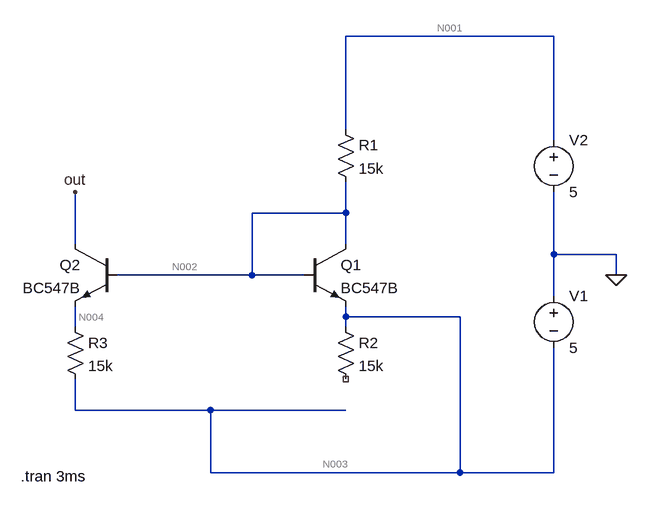
[diagram p0: schematic Draft1.asc]
Draft1.asc, the LTspice schematic file:
Version 4
SHEET 1 880 680
WIRE 528 -96 208 -96
WIRE 208 48 208 -96
WIRE 528 64 528 -96
WIRE 208 176 208 128
WIRE 208 176 64 176
WIRE -208 224 -208 144
WIRE 208 224 208 176
WIRE 528 240 528 144
WIRE 624 240 528 240
WIRE 64 272 64 176
WIRE 64 272 -144 272
WIRE 144 272 64 272
WIRE 624 272 624 240
WIRE 528 304 528 240
WIRE 208 336 208 320
WIRE 384 336 208 336
WIRE -208 352 -208 320
WIRE 208 352 208 336
WIRE -208 480 -208 432
WIRE 0 480 -208 480
WIRE 208 480 0 480
WIRE 0 576 0 480
WIRE 384 576 384 336
WIRE 384 576 0 576
WIRE 528 576 528 384
WIRE 528 576 384 576
FLAG 624 272 0
FLAG -208 144 out
SYMBOL res 192 32 R0
SYMATTR InstName R1
SYMATTR Value 15k
SYMBOL res 192 336 R0
SYMATTR InstName R2
SYMATTR Value 15k
SYMBOL npn 144 224 R0
SYMATTR InstName Q1
SYMATTR Value BC547B
SYMBOL npn -144 224 M0
SYMATTR InstName Q2
SYMATTR Value BC547B
SYMBOL res -224 336 R0
SYMATTR InstName R3
SYMATTR Value 15k
SYMBOL voltage 528 288 R0
WINDOW 123 0 0 Left 0
WINDOW 39 0 0 Left 0
SYMATTR InstName V1
SYMATTR Value 5
SYMBOL voltage 528 48 R0
WINDOW 123 0 0 Left 0
WINDOW 39 0 0 Left 0
SYMATTR InstName V2
SYMATTR Value 5
TEXT -292 582 Left 2 !.tran 3ms

The netlist it stands for:
* Draft1.asc
R1 N001 N002 15k
R2 N003 NC_01 15k
Q1 N002 N002 N003 0 BC547B
Q2 out N002 N004 0 BC547B
R3 N004 N003 15k
V1 0 N003 5
V2 N001 0 5
.model NPN NPN
.model PNP PNP
.lib standard.bjt
.tran 3ms
.backanno
.end

* Results of the author's LTspice run, read from the files saved beside the schematic
* Operating Point, zero values left out:
*   V(n001) = 5 V
*   V(n002) = -4.374 V
*   V(n003) = -5 V
*   V(out) = -4.917 V
*   V(n004) = -4.923 V
*   Ib(Q2) = 5.109 µA
*   Ie(Q2) = -5.109 µA
*   Ic(Q1) = 617.6 µA
*   Ib(Q1) = 2.184 µA
*   Ie(Q1) = -619.8 µA
*   I(R3) = 5.109 µA
*   I(R1) = 624.9 µA
*   I(V2) = -624.9 µA
*   I(V1) = -624.9 µA